# Altium project PROC101D_SCH_With_Design_Updates..Notes_V1.0.PrjPcb (part 7 of 23)

## Sheet 18.SchDoc
size 513 x 386 mm
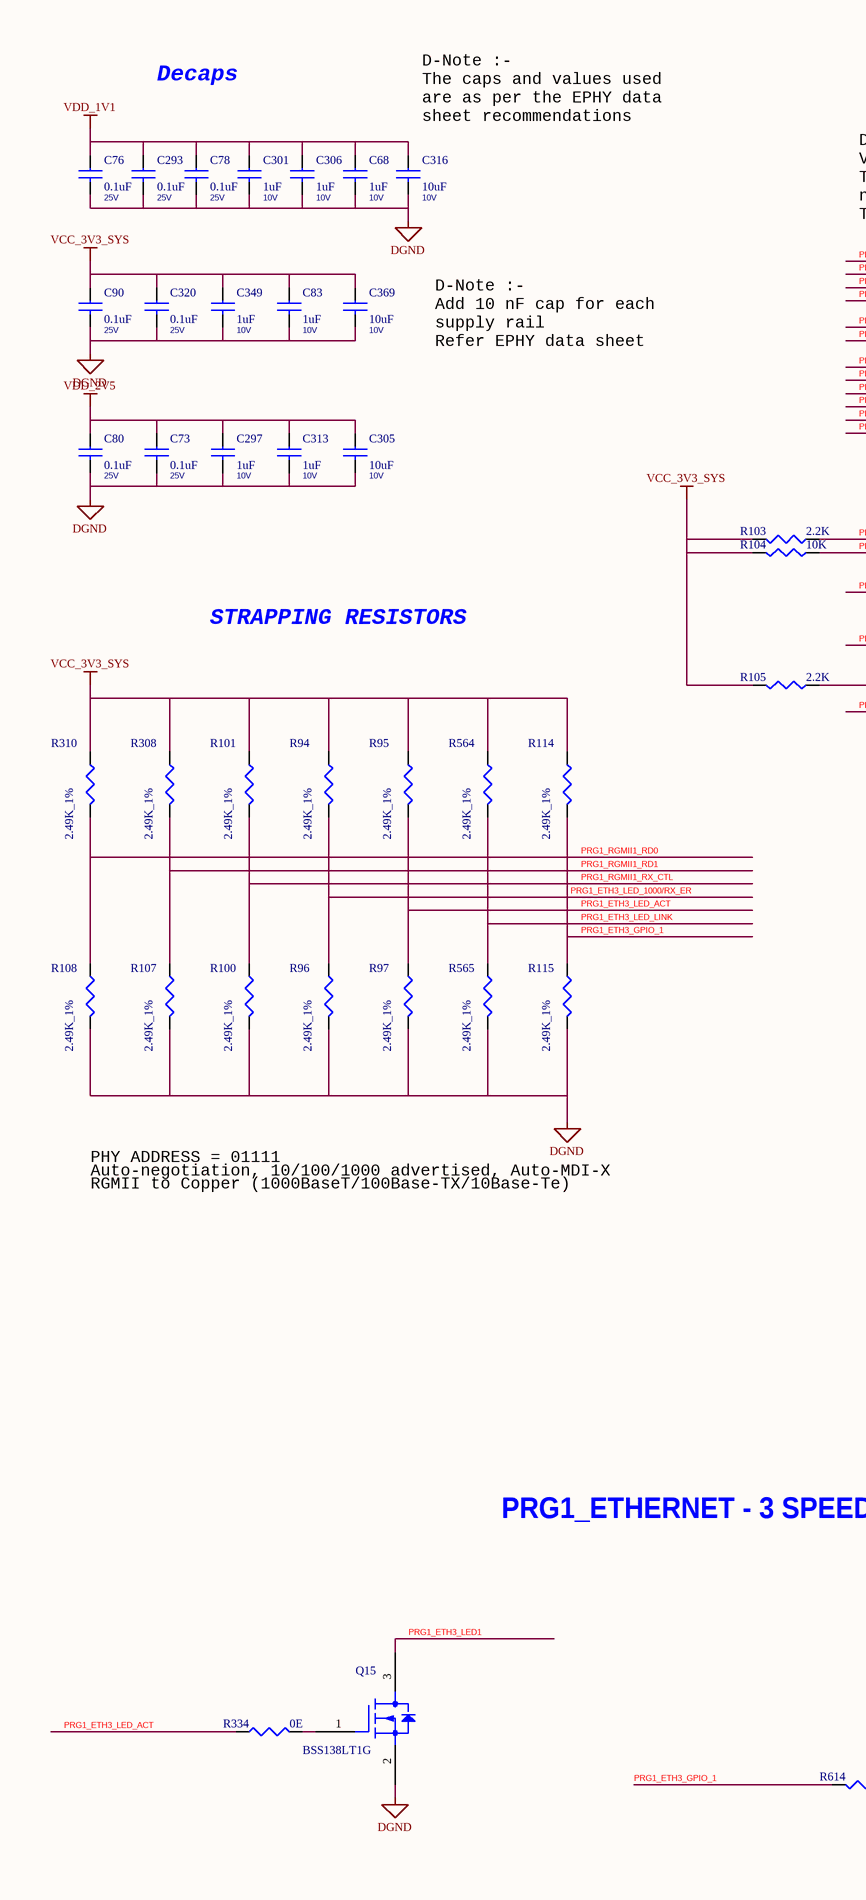
[diagram p27: 18.SchDoc, left]
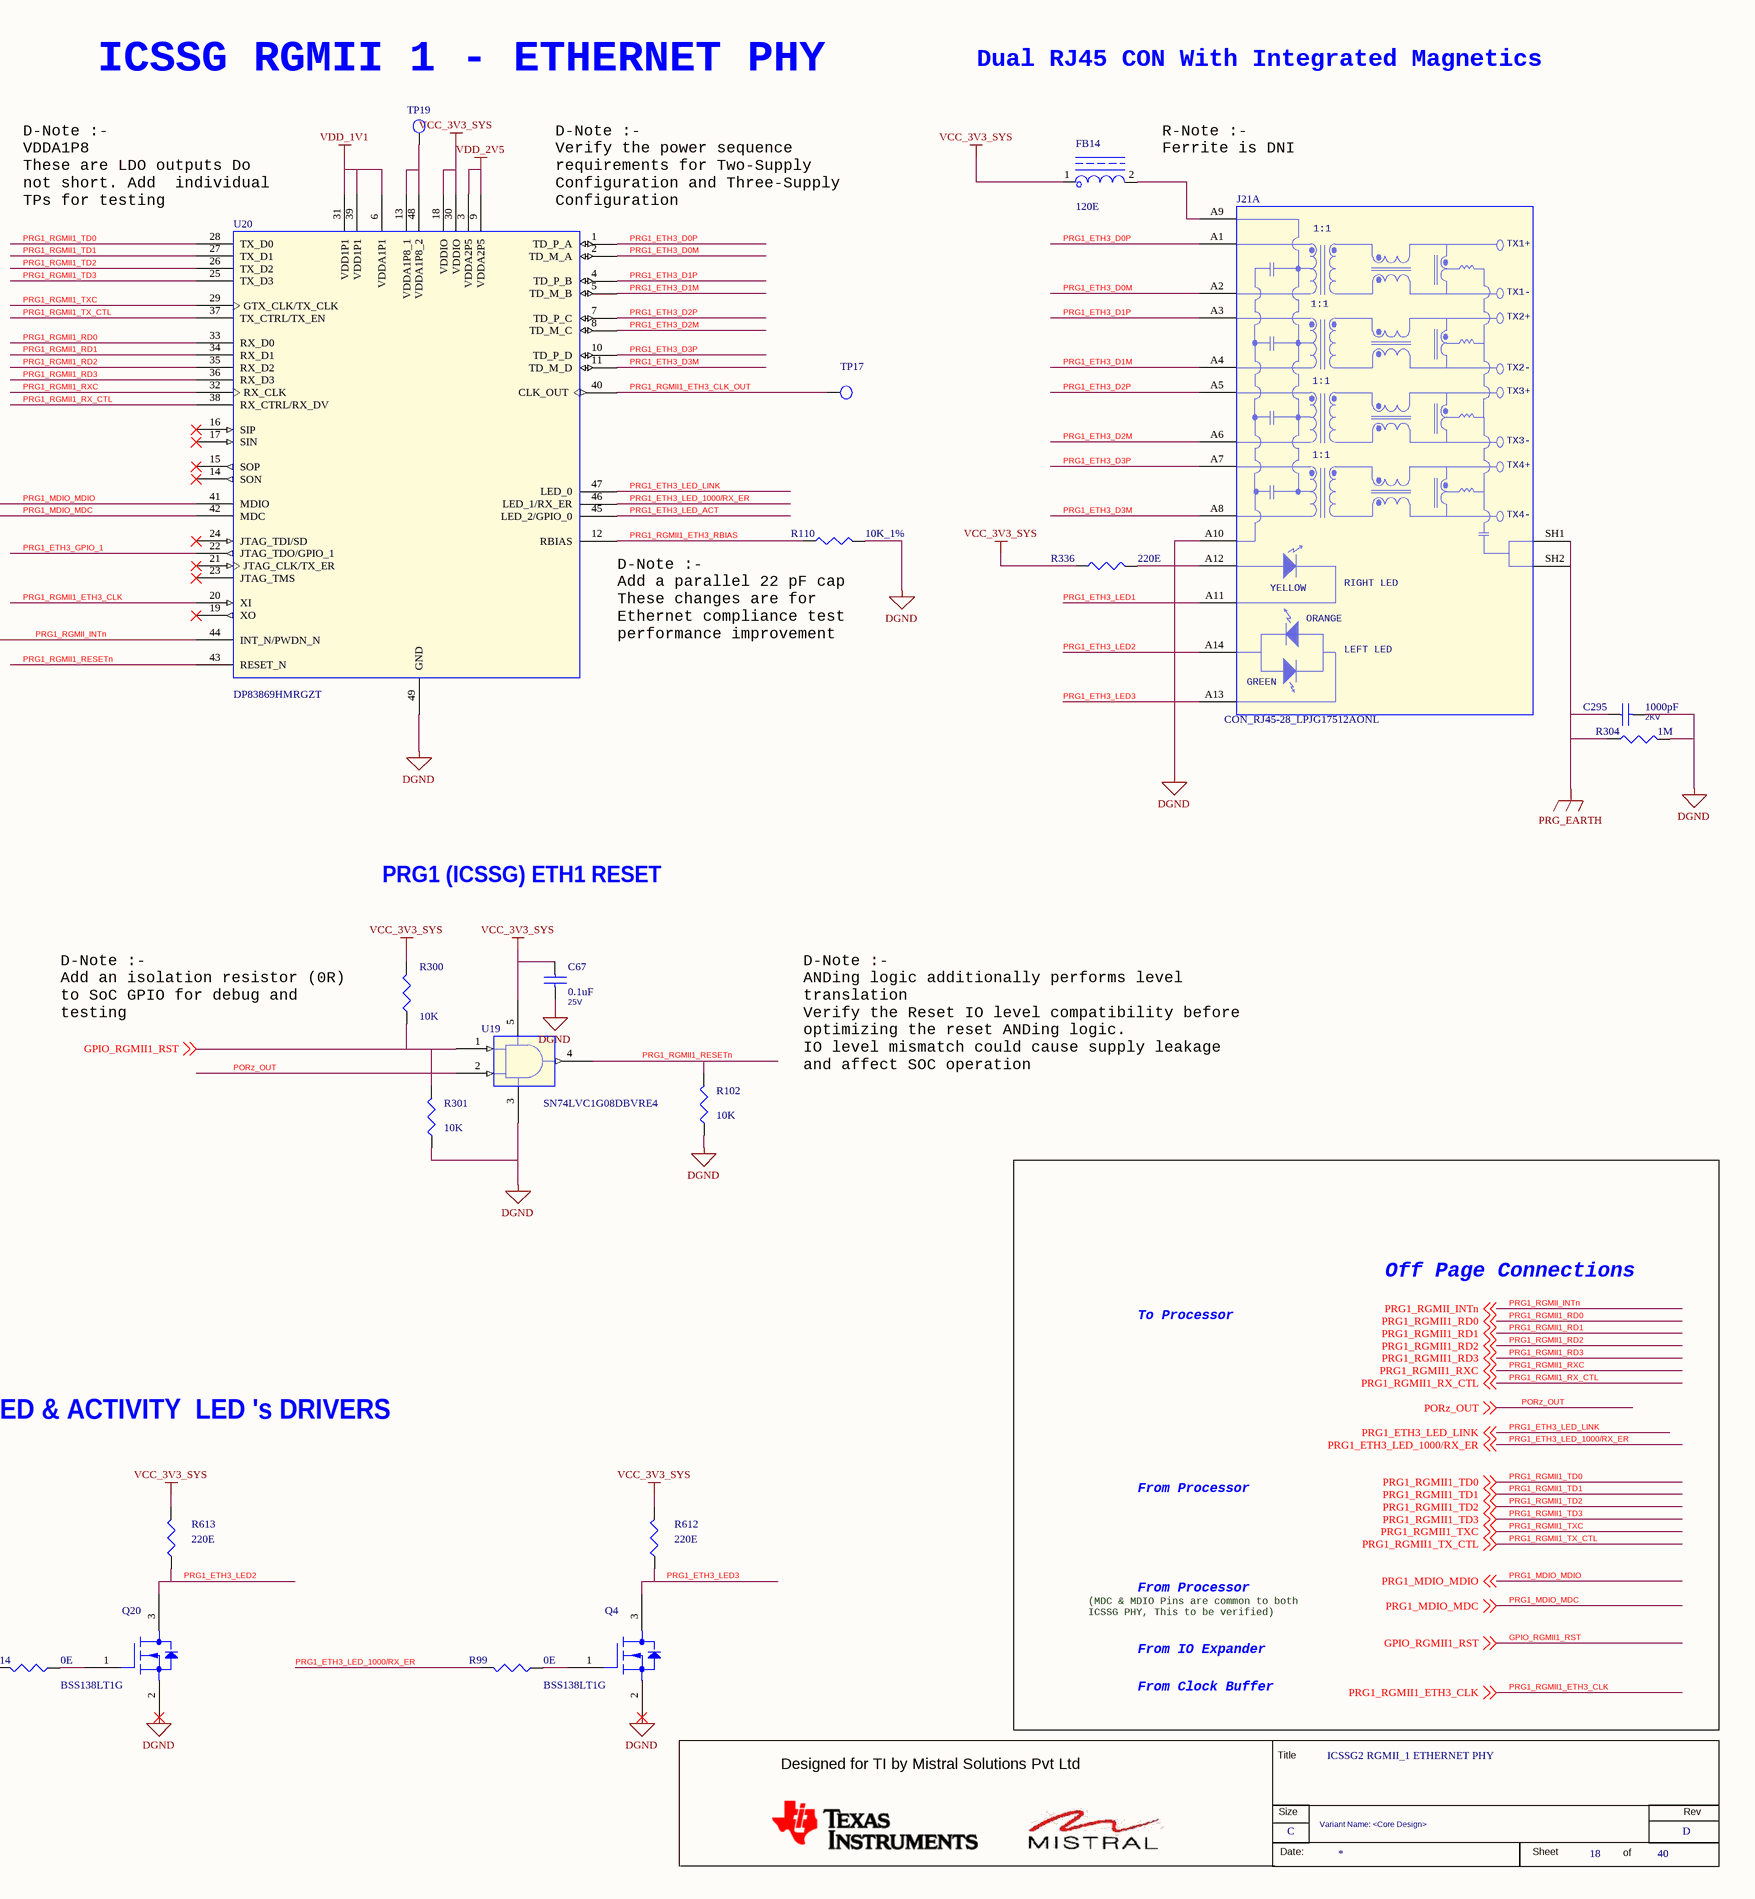
[diagram p28: 18.SchDoc, right]

### Parts
(Parts that share a designator on the sheet are numbered #1, #2 ... from top to bottom, then left to right.)
*#18  RevCode: D  Title: ICSSG2 RGMII_1 ETHERNET PHY  Page Size: C  Page Number: 18  Page Count: 40  Variant Name: <Core Design>  (hidden comment: MISTRAL_TITLEBLK_CSIZE)  (graphical)
C67  0.1uF  Voltage: 25V  [CAP0402_0-75]
C68  1uF  Voltage: 10V  [CAP0402_0-75]
C73  0.1uF  Voltage: 25V  [CAP0402_0-75]
C76  0.1uF  Voltage: 25V  [CAP0402_0-75]
C78  0.1uF  Voltage: 25V  [CAP0402_0-75]
C80  0.1uF  Voltage: 25V  [CAP0402_0-75]
C83  1uF  Voltage: 10V  [CAP0402_0-75]
C90  0.1uF  Voltage: 25V  [CAP0402_0-75]
C293  0.1uF  Voltage: 25V  [CAP0402_0-75]
C295  1000pF  Voltage: 2KV  [CAP1206_1-75]
C297  1uF  Voltage: 10V  [CAP0402_0-75]
C301  1uF  Voltage: 10V  [CAP0402_0-75]
C305  10uF  Voltage: 10V  [CAP0402_0-75]
C306  1uF  Voltage: 10V  [CAP0402_0-75]
C313  1uF  Voltage: 10V  [CAP0402_0-75]
C316  10uF  Voltage: 10V  [CAP0402_0-75]
C320  0.1uF  Voltage: 25V  [CAP0402_0-75]
C349  1uF  Voltage: 10V  [CAP0402_0-75]
C369  10uF  Voltage: 10V  [CAP0402_0-75]
FB14  120E  [IND0603_1]
J21  CON_RJ45-28_LPJG17512AONL  [CON_RJ45-28_LPJG17512_S_R_T_25-3]  (part A of 2)
Q4  BSS138LT1G  [SOT23-123_1-2]
Q15  BSS138LT1G  [SOT23-123_1-2]
Q20  BSS138LT1G  [SOT23-123_1-2]
R94  2.49K_1%  [RES0402_0-5]
R95  2.49K_1%  [RES0402_0-5]
R96  2.49K_1%  [RES0402_0-5]
R97  2.49K_1%  [RES0402_0-5]
R99  0E  [RES0402_0-5]
R100  2.49K_1%  [RES0402_0-5]
R101  2.49K_1%  [RES0402_0-5]
R102  10K  [RES0402_0-5]
R103  2.2K  [RES0402_0-5]
R104  10K  [RES0402_0-5]
R105  2.2K  [RES0402_0-5]
R107  2.49K_1%  [RES0402_0-5]
R108  2.49K_1%  [RES0402_0-5]
R110  10K_1%  [RES0402_0-5]
R114  2.49K_1%  [RES0402_0-5]
R115  2.49K_1%  [RES0402_0-5]
R300  10K  [RES0402_0-5]
R301  10K  [RES0402_0-5]
R304  1M  [RES0603_0-75]
R308  2.49K_1%  [RES0402_0-5]
R310  2.49K_1%  [RES0402_0-5]
R334  0E  [RES0402_0-5]
R336  220E  [RES0402_0-5]
R564  2.49K_1%  [RES0402_0-5]
R565  2.49K_1%  [RES0402_0-5]
R612  220E  [RES0402_0-5]
R613  220E  [RES0402_0-5]
R614  0E  [RES0402_0-5]
TP17  TP20_SMD  [TP20_SMD]  (value not drawn)
TP19  TP20_SMD  [TP20_SMD]  (value not drawn)
U19  SN74LVC1G08DBVRE4  [SOT23-5]
U20  DP83869HMRGZT  [QFN48_19-68_280X280_1_EP4-2]

### Nets
DGND: C67.2 C68.2 C73.2 C76.2 C78.2 C80.2 C83.2 C90.2 C293.2 C295.2 C297.2 C301.2 C305.2 C306.2 C313.2 C316.2 C320.2 C349.2 C369.2 J21.A10(GND) Q4.2(S) Q15.2(S) Q20.2(S) R96.2 R97.2 R100.2 R102.2 R107.2 R108.2 R110.1 R115.2 R301.2 R304.2 R565.2 U19.3(GND) U20.49(GND)
PRG_EARTH: C295.1 J21.SH1 J21.SH2 R304.1
VCC_3V3_SYS: C67.1 C83.1 C90.1 C320.1 C349.1 C369.1 FB14.1 R94.1 R95.1 R101.1 R103.2 R104.1 R105.2 R114.1 R300.2 R308.1 R310.1 R336.1 R564.1 R612.2 R613.2 U19.5(VCC) U20.18(VDDIO) U20.30(VDDIO)
VDD_1V1: C68.1 C76.1 C78.1 C293.1 C301.1 C306.1 C316.1 U20.6(VDDA1P1) U20.31(VDD1P1) U20.39(VDD1P1)
VDD_2V5: C73.1 C80.1 C297.1 C305.1 C313.1 U20.3(VDDA2P5) U20.9(VDDA2P5)
GPIO_RGMII1_RST: R300.1 R301.1 U19.1(A) ; off-sheet GPIO_RGMII1_RST
PORz_OUT: U19.2(B) ; off-sheet PORz_OUT
PRG1_ETH3_D0M: J21.A2(TD1-_1) U20.2(TD_M_A)
PRG1_ETH3_D0P: J21.A1(TD1+_1) U20.1(TD_P_A)
PRG1_ETH3_D1M: J21.A4(TD2-_1) U20.5(TD_M_B)
PRG1_ETH3_D1P: J21.A3(TD2+_1) U20.4(TD_P_B)
PRG1_ETH3_D2M: J21.A6(TD3-_1) U20.8(TD_M_C)
PRG1_ETH3_D2P: J21.A5(TD3+_1) U20.7(TD_P_C)
PRG1_ETH3_D3M: J21.A8(TD4-_1) U20.11(TD_M_D)
PRG1_ETH3_D3P: J21.A7(TD4+_1) U20.10(TD_P_D)
PRG1_ETH3_GPIO_1: R114.2 R115.1 R614.2 U20.22(JTAG_TDO/GPIO_1)
PRG1_ETH3_LED1: J21.A11 Q15.3(D)
PRG1_ETH3_LED2: J21.A14 Q20.3(D) R613.1
PRG1_ETH3_LED3: J21.A13 Q4.3(D) R612.1
PRG1_ETH3_LED_1000/RX_ER: R94.2 R96.1 R99.2 U20.46(LED_1/RX_ER) ; off-sheet PRG1_ETH3_LED_1000/RX_ER
PRG1_ETH3_LED_ACT: R95.2 R97.1 R334.1 U20.45(LED_2/GPIO_0)
PRG1_ETH3_LED_LINK: R564.2 R565.1 U20.47(LED_0) ; off-sheet PRG1_ETH3_LED_LINK
PRG1_MDIO_MDC: R104.2 U20.42(MDC) ; off-sheet PRG1_MDIO_MDC
PRG1_MDIO_MDIO: R103.1 U20.41(MDIO) ; off-sheet PRG1_MDIO_MDIO
PRG1_RGMII1_ETH3_CLK: U20.20(XI) ; off-sheet PRG1_RGMII1_ETH3_CLK
PRG1_RGMII1_ETH3_CLK_OUT: TP17.1(TP) U20.40(CLK_OUT)
PRG1_RGMII1_ETH3_RBIAS: R110.2 U20.12(RBIAS)
PRG1_RGMII1_RD0: R108.1 R310.2 U20.33(RX_D0) ; off-sheet PRG1_RGMII1_RD0
PRG1_RGMII1_RD1: R107.1 R308.2 U20.34(RX_D1) ; off-sheet PRG1_RGMII1_RD1
PRG1_RGMII1_RD2: U20.35(RX_D2) ; off-sheet PRG1_RGMII1_RD2
PRG1_RGMII1_RD3: U20.36(RX_D3) ; off-sheet PRG1_RGMII1_RD3
PRG1_RGMII1_RESETn: R102.1 U19.4(Y) U20.43(RESET_N)
PRG1_RGMII1_RX_CTL: R100.1 R101.2 U20.38(RX_CTRL/RX_DV) ; off-sheet PRG1_RGMII1_RX_CTL
PRG1_RGMII1_RXC: U20.32(RX_CLK) ; off-sheet PRG1_RGMII1_RXC
PRG1_RGMII1_TD0: U20.28(TX_D0) ; off-sheet PRG1_RGMII1_TD0
PRG1_RGMII1_TD1: U20.27(TX_D1) ; off-sheet PRG1_RGMII1_TD1
PRG1_RGMII1_TD2: U20.26(TX_D2) ; off-sheet PRG1_RGMII1_TD2
PRG1_RGMII1_TD3: U20.25(TX_D3) ; off-sheet PRG1_RGMII1_TD3
PRG1_RGMII1_TX_CTL: U20.37(TX_CTRL/TX_EN) ; off-sheet PRG1_RGMII1_TX_CTL
PRG1_RGMII1_TXC: U20.29(GTX_CLK/TX_CLK) ; off-sheet PRG1_RGMII1_TXC
PRG1_RGMII_INTn: R105.1 U20.44(INT_N/PWDN_N) ; off-sheet PRG1_RGMII_INTn
NetFB14_2: FB14.2 J21.A9(VCC)
NetJ21_A12: J21.A12 R336.2
NetQ4_1: Q4.1(G) R99.1
NetQ15_1: Q15.1(G) R334.2
NetQ20_1: Q20.1(G) R614.1
NetTP19_1: TP19.1(TP) U20.13(VDDA1P8_1) U20.48(VDDA1P8_2)

Not connected (* = marked no-connect by the designer): U20 14(SON)* 15(SOP)* 16(SIP)* 17(SIN)* 19(XO)* 21(JTAG_CLK/TX_ER)* 23(JTAG_TMS)* 24(JTAG_TDI/SD)*

### Notes on the sheet
- (near C316) D-Note :-
  The caps and values used
  are as per the EPHY data
  sheet recommendations
- Decaps
- ICSSG RGMII 1 - ETHERNET PHY
- Dual RJ45 CON With Integrated Magnetics
- (near U20) D-Note :-
  VDDA1P8
  These are LDO outputs Do
  not short. Add  individual
  TPs for testing
- (near U20) D-Note :-
  Verify the power sequence
  requirements for Two-Supply
  Configuration and Three-Supply
  Configuration
- R-Note :-
  Ferrite is DNI
- D-Note :-
  Add 10 nF cap for each
  supply rail
  Refer EPHY data sheet
- STRAPPING RESISTORS
- (near R110) D-Note :-
  Add a parallel 22 pF cap
  These changes are for
  Ethernet compliance test
  performance improvement
- PRG1 (ICSSG) ETH1 RESET
- (near R300) D-Note :-
  Add an isolation resistor (0R)
  to SoC GPIO for debug and
  testing
- D-Note :-
  ANDing logic additionally performs level
  translation
  Verify the Reset IO level compatibility before
  optimizing the reset ANDing logic.
  IO level mismatch could cause supply leakage
  and affect SOC operation
- PHY ADDRESS = 01111
- Auto-negotiation, 10/100/1000 advertised, Auto-MDI-X
- RGMII to Copper (1000BaseT/100Base-TX/10Base-Te)
- Off Page Connections
- To Processor
- PRG1_ETHERNET - 3 SPEED & ACTIVITY  LED 's DRIVERS
- From Processor
- (MDC & MDIO Pins are common to both
  ICSSG PHY, This to be verified)
- From IO Expander
- From Clock Buffer
- (in symbol CON_RJ45-28_LPJG17512AONL, part A) 1:1; TX1+; TX1-; TX2+; TX2-; TX3+; TX3-; TX4+; TX4-; RIGHT LED; YELLOW; ORANGE; LEFT LED; GREEN
- (in symbol MISTRAL_TITLEBLK_CSIZE) Title; Designed for TI by Mistral Solutions Pvt Ltd; Size; Rev; Date:; Sheet; of

### Library data of the parts
*#18 = MISTRAL_TITLEBLK_CSIZE: Issue: 1.0; Page Create Date: March  8, 1995; Page Modify Date: *
C67 C73 C76 C78 C80 C90 C293 C320 = CAP_Dup3: CAP CERAMIC 0.1uF 25V 20% X5R 0402; Alt_Mfr_name: YAGEO AMERICA; Part_type: CAPACITORS\CERAMIC; Mfr_part_number: 885012105018; Mfr_name: WURTH ELECTRONICS; Mistral Part No: 120020080003-R; Alt_Mfr_part_number: CC0402KRX5R8BB104; Custom_Duty: 15%; Customs_HS_Code: 85322990; Wattage: NA; Project: AM64x_EVM_BRD; Footprint Path: Y:\MIS_DATABASE\Library\ALTIUM_TOOL\PCB_FOOTPRINTS\Altium_Footprint_Lib.PcbLib; Library Path: Y:\MIS_DATABASE\Library\ALTIUM_TOOL\SCHEMATICS_PARTS\MS_DISCRETE_Library.schlib; Footprint Ref: CAP0402_0-75; Library Ref: CAP; MECHANICAL 3D STEP FILE: CAP0402_0-75; Chkd/date: MANIRAJA/170820; Crtd /date: ALVY/170820; Datasheet: Y:\MIS_DATABASE\DATASHEETS\CAPACITORS\885012105018.PDF; Temperature: -55癈+85癈; Weight: 0.65mg; Height: 0.55MM; Distributor_part_number: 732-7495-1-ND; Distributor_name: DIGIKEY; Package: 0402; Tolerance: 20%; PCB Footprint: CAP0402_0-75
C68 C297 C301 C313 C349 = CAP_Dup3: as C101 on sheet 17; Footprint Ref: CAP0402_0-75; Library Ref: CAP; Chkd/date: MANIRAJA/210820; Crtd /date: ALVY/190820; Datasheet: Y:\MIS_DATABASE\DATASHEETS\CAPACITORS\885012105012.PDF; Temperature: -55癈+85癈; Weight: 0.65mg; Height: 0.55MM; Distributor_part_number: 732-7489-1-ND; Distributor_name: DIGIKEY; Package: 0402; Tolerance: 20%; MECHANICAL 3D STEP FILE: CAP0402_0-75; Library Path: Y:\MIS_DATABASE\Library\ALTIUM_TOOL\SCHEMATICS_PARTS\MS_DISCRETE_Library.schlib; Footprint Path: Y:\MIS_DATABASE\Library\ALTIUM_TOOL\PCB_FOOTPRINTS\Altium_Footprint_Lib.PcbLib; PCB Footprint: CAP0402_0-75
C83 C306 = CAP_Dup3: as C401 on sheet 17; Footprint Path: Y:\MIS_DATABASE\Library\ALTIUM_TOOL\PCB_FOOTPRINTS\Altium_Footprint_Lib.PcbLib; Library Path: Y:\MIS_DATABASE\Library\ALTIUM_TOOL\SCHEMATICS_PARTS\MS_DISCRETE_Library.schlib; MECHANICAL 3D STEP FILE: CAP0402_0-75; Tolerance: 20%; Package: 0402; Distributor_name: DIGIKEY; Distributor_part_number: 732-7489-1-ND; Height: 0.55MM; Weight: 0.65mg; Temperature: -55癈+85癈; Datasheet: Y:\MIS_DATABASE\DATASHEETS\CAPACITORS\885012105012.PDF; Crtd /date: ALVY/190820; Chkd/date: MANIRAJA/210820; Library Ref: CAP; Footprint Ref: CAP0402_0-75; PCB Footprint: CAP0402_0-75
C295 = CAP_Dup3: CAP CERAMIC 1000pF 2KV 10% X7R 1206; Mistral Part No: 120015080006-R; Mfr_name: AVX CORPORATION; Mfr_part_number: 1206GC102KAT1A; Part_type: CAPACITORS\CERAMIC; Project: ADR1B; Customs_HS_Code: 85322990; Custom_Duty: 15%; Wattage: NA; Tolerance: 10%; Package: 1206; Distributor_name: DIGIKEY; Distributor_part_number: 478-2956-1-ND; Height: 1.52MM; Weight: 16.2mg; Temperature: -55癈+125癈; Datasheet: Y:\MIS_DATABASE\DATASHEETS\CAPACITORS\AVX_HV-MLC.PDF; Crtd /date: MAZHAR/281106; Chkd/date: SHREESHAIL/291106; Library Ref: CAP; Footprint Ref: CAP1206_1-75; Library Path: Y:\MIS_DATABASE\Library\ALTIUM_TOOL\SCHEMATICS_PARTS\MS_DISCRETE_Library.schlib; Footprint Path: Y:\MIS_DATABASE\Library\ALTIUM_TOOL\PCB_FOOTPRINTS\Altium_Footprint_Lib.PcbLib; MECHANICAL 3D STEP FILE: CAP1206_1-75; PCB Footprint: CAP1206_1-75
C305 = CAP_Dup3: as C111 on sheet 17; Footprint Path: Y:\MIS_DATABASE\Library\ALTIUM_TOOL\PCB_FOOTPRINTS\Altium_Footprint_Lib.PcbLib; Library Path: Y:\MIS_DATABASE\Library\ALTIUM_TOOL\SCHEMATICS_PARTS\MS_DISCRETE_Library.schlib; Footprint Ref: CAP0402_0-75; Chkd/date: MANIRAJA/300520; Crtd /date: ALVY/260520; Datasheet: Y:\MIS_DATABASE\DATASHEETS\CAPACITORS\MURATA-GXX-SER_NOV17.PDF; Height: 0.55MM; Distributor_part_number: 490-GRM155R61A106ME11DTR-ND; Distributor_name: DIGIKEY; Package: 0402; Tolerance: 20%; Weight: 3.1mg; Temperature: -55癈+85癈; MECHANICAL 3D STEP FILE: CAP0402_0-75; Library Ref: CAP; PCB Footprint: CAP0402_0-75
C316 = CAP_Dup3: as C105 on sheet 17; Footprint Path: Y:\MIS_DATABASE\Library\ALTIUM_TOOL\PCB_FOOTPRINTS\Altium_Footprint_Lib.PcbLib; Library Path: Y:\MIS_DATABASE\Library\ALTIUM_TOOL\SCHEMATICS_PARTS\MS_DISCRETE_Library.schlib; Footprint Ref: CAP0402_0-75; Library Ref: CAP; MECHANICAL 3D STEP FILE: CAP0402_0-75; Temperature: -55癈+85癈; Weight: 3.1mg; Tolerance: 20%; Package: 0402; Distributor_name: DIGIKEY; Distributor_part_number: 490-GRM155R61A106ME11DTR-ND; Height: 0.55MM; Datasheet: Y:\MIS_DATABASE\DATASHEETS\CAPACITORS\MURATA-GXX-SER_NOV17.PDF; Crtd /date: ALVY/260520; Chkd/date: MANIRAJA/300520; PCB Footprint: CAP0402_0-75
C369 = CAP_Dup3: as C99 on sheet 17; Footprint Path: Y:\MIS_DATABASE\Library\ALTIUM_TOOL\PCB_FOOTPRINTS\Altium_Footprint_Lib.PcbLib; Library Path: Y:\MIS_DATABASE\Library\ALTIUM_TOOL\SCHEMATICS_PARTS\MS_DISCRETE_Library.schlib; Footprint Ref: CAP0402_0-75; Library Ref: CAP; MECHANICAL 3D STEP FILE: CAP0402_0-75; Temperature: -55癈+85癈; Weight: 3.1mg; Chkd/date: MANIRAJA/300520; Crtd /date: ALVY/260520; Datasheet: Y:\MIS_DATABASE\DATASHEETS\CAPACITORS\MURATA-GXX-SER_NOV17.PDF; Height: 0.55MM; Distributor_part_number: 490-GRM155R61A106ME11DTR-ND; Distributor_name: DIGIKEY; Package: 0402; Tolerance: 20%; PCB Footprint: CAP0402_0-75
FB14 = INDUCTOR_FERRITE: as FB19 on sheet 17; PCB Footprint: IND0603_1; Footprint Ref: IND0603_1; Part_type: INDUCTOR; Wattage: NA; Package: 0603; Distributor_name: DIGIKEY; Distributor_part_number: 732-782631141CT-ND; Library Ref: INDUCTOR_FERRITE; Height: 1.00MM; Weight: NA; Temperature: -55癈+125癈; Datasheet: Y:\MIS_DATABASE\DATASHEETS\DISCRETES\INDUCTORS\782631141.PDF; Crtd /date: ALVY/180820; Chkd/date: MANIRAJA/180820; MECHANICAL 3D STEP FILE: IND0603_1; Library Path: Y:\MIS_DATABASE\Library\ALTIUM_TOOL\SCHEMATICS_PARTS\MS_FILTER_Library.schlib; Footprint Path: Y:\MIS_DATABASE\Library\ALTIUM_TOOL\PCB_FOOTPRINTS\Altium_Footprint_Lib.PcbLib
J21 = CON_RJ45-28_LPJG17512AONL: as J21 on sheet 17; Mfr_part_number: LPJG17512AONL; Voltage: NA; Wattage: NA; Package: THRU-HOLE; Distributor_name: NA; Distributor_part_number: NA; Height: 25.30MM; Weight: NA; Temperature: 0癈+70癈; Datasheet: Y:\MIS_DATABASE\DATASHEETS\CONNECTORS\LPJG17512AONL.PDF; Crtd /date: MANIRAJA/010817; Chkd/date: MANIRAJA/010817; MECHANICAL 3D STEP FILE: CON_RJ45-28_LPJG17512_S_R_T_25-3; Library Ref: CON_RJ45-28_LPJG17512AONL; PCB Footprint: CON_RJ45-28_LPJG17512_S_R_T_25-3
Q4 Q15 Q20 = MOSFET_BSS138LT1G: as Q14 on sheet 17; Footprint Path: Y:\MIS_DATABASE\Library\ALTIUM_TOOL\PCB_FOOTPRINTS\Altium_Footprint_Lib.PcbLib; Library Path: Y:\MIS_DATABASE\Library\ALTIUM_TOOL\SCHEMATICS_PARTS\MS_MOSFET_Library.schlib; MECHANICAL 3D STEP FILE: SOT23-123_1-2; Footprint Ref: SOT23-123_1-2; Mfr_part_number: BSS138LT1G; Voltage: NA; Wattage: NA; Package: SOT23-3; Distributor_name: DIGIKEY; Distributor_part_number: BSS138LT1GOSCT-ND; Height: 1.11MM; Weight: 8mg; Temperature: -55癈+150癈; Datasheet: Y:\MIS_DATABASE\DATASHEETS\DISCRETES\TRANSISTORS_FETS\BSS138LT1G.PDF; Crtd /date: JEBRAN/060416; Chkd/date: MANIRAJA/250219; Library Ref: MOSFET_BSS138W; PCB Footprint: SOT23-123_1-2
R94 R97 R115 R308 R310 R564 R565 = RESISTOR_Dup6: as R135 on sheet 17; Tolerance: 1%; Wattage: 1/16W; Package: 0402; Distributor_name: DIGIKEY; Distributor_part_number: 311-2.49KLRCT-ND; Height: 0.40MM; Weight: 0.65mg; Temperature: -55癈+155癈; Datasheet: Y:\MIS_DATABASE\DATASHEETS\RESISTORS\RCXXXXL-SER_MAR18.PDF; Crtd /date: VASANTHA/270516; Chkd/date: VASANTHA/270516; Library Ref: RESISTOR; Footprint Ref: RES0402_0-5; MECHANICAL 3D STEP FILE: RES0402_0-5; Library Path: Y:\MIS_DATABASE\Library\ALTIUM_TOOL\SCHEMATICS_PARTS\MS_DISCRETE_Library.schlib; Footprint Path: Y:\MIS_DATABASE\Library\ALTIUM_TOOL\PCB_FOOTPRINTS\Altium_Footprint_Lib.PcbLib; PCB Footprint: RES0402_0-5
R95 R96 R100 R101 R107 R108 R114 = RESISTOR_Dup6: as R126 on sheet 17; Library Ref: RESISTOR; Chkd/date: VASANTHA/270516; Crtd /date: VASANTHA/270516; Datasheet: Y:\MIS_DATABASE\DATASHEETS\RESISTORS\RCXXXXL-SER_MAR18.PDF; Temperature: -55癈+155癈; Weight: 0.65mg; Height: 0.40MM; Distributor_part_number: 311-2.49KLRCT-ND; Distributor_name: DIGIKEY; Package: 0402; Wattage: 1/16W; Tolerance: 1%; Footprint Ref: RES0402_0-5; MECHANICAL 3D STEP FILE: RES0402_0-5; Library Path: Y:\MIS_DATABASE\Library\ALTIUM_TOOL\SCHEMATICS_PARTS\MS_DISCRETE_Library.schlib; Footprint Path: Y:\MIS_DATABASE\Library\ALTIUM_TOOL\PCB_FOOTPRINTS\Altium_Footprint_Lib.PcbLib; PCB Footprint: RES0402_0-5
R99 R614 = RESISTOR_Dup5: RES 0E 1/16W JUMPER 0402; Mistral Part No: 110010080019-R; Mfr_name: VISHAY; Mfr_part_number: CRCW04020000Z0ED; Part_type: RESISTORS\FIXED; Project: PB_BUGBASE; Tolerance: NA; Customs_HS_Code: 85332119; Custom_Duty: 15%; Voltage: NA; Wattage: 1/16W; Package: 0402; Distributor_name: DIGIKEY; Distributor_part_number: 541-0.0JCT-ND; Height: 0.40MM; Weight: 0.65mg; Temperature: -55癈+155癈; Datasheet: Y:\MIS_DATABASE\DATASHEETS\RESISTORS\CRCW0603.PDF; Crtd /date: MUDDU/190810; Chkd/date: VASANTHA/201216; MECHANICAL 3D STEP FILE: RES0402_0-5; Library Ref: RESISTOR; Footprint Ref: RES0402_0-5; Library Path: Y:\MIS_DATABASE\Library\ALTIUM_TOOL\SCHEMATICS_PARTS\MS_DISCRETE_Library.schlib; Footprint Path: Y:\MIS_DATABASE\Library\ALTIUM_TOOL\PCB_FOOTPRINTS\Altium_Footprint_Lib.PcbLib; PCB Footprint: RES0402_0-5
R102 R104 R300 = RESISTOR_Dup6: as R120 on sheet 17; Tolerance: 5%; Wattage: 1/16W; Package: 0402; Distributor_name: DIGIKEY; Distributor_part_number: 311-10KJRCT-ND; Height: 0.40MM; Weight: 0.65mg; Temperature: -55癈+155癈; Datasheet: Y:\MIS_DATABASE\DATASHEETS\RESISTORS\RCXXXXL-SER_MAR18.PDF; Crtd /date: MAZHAR/230805; Chkd/date: VASANTHA/061216; MECHANICAL 3D STEP FILE: RES0402_0-5; Library Ref: RESISTOR; Footprint Ref: RES0402_0-5; Library Path: Y:\MIS_DATABASE\Library\ALTIUM_TOOL\SCHEMATICS_PARTS\MS_DISCRETE_Library.schlib; Footprint Path: Y:\MIS_DATABASE\Library\ALTIUM_TOOL\PCB_FOOTPRINTS\Altium_Footprint_Lib.PcbLib; PCB Footprint: RES0402_0-5
R103 R105 = RESISTOR_Dup6: RES 2.2K 1/16W 5% 0402; Mistral Part No: 110010120018-R; Mfr_name: YAGEO AMERICA; Mfr_part_number: RC0402JR-072K2L; Part_type: RESISTORS\FIXED; Project: TE4; Voltage: NA; Customs_HS_Code: 85332119; Custom_Duty: 15%; Tolerance: 5%; Wattage: 1/16W; Package: 0402; Distributor_name: DIGIKEY; Distributor_part_number: 311-2.2KJRCT-ND; Height: 0.40MM; Weight: 0.65mg; Temperature: -55癈+155癈; Datasheet: Y:\MIS_DATABASE\DATASHEETS\RESISTORS\RCXXXXL-SER_MAR18.PDF; Crtd /date: BAVISH/021210; Chkd/date: VASANTHA/061216; MECHANICAL 3D STEP FILE: RES0402_0-5; Footprint Path: Y:\MIS_DATABASE\Library\ALTIUM_TOOL\PCB_FOOTPRINTS\Altium_Footprint_Lib.PcbLib; Library Ref: RESISTOR; Footprint Ref: RES0402_0-5; Library Path: Y:\MIS_DATABASE\Library\ALTIUM_TOOL\SCHEMATICS_PARTS\MS_DISCRETE_Library.schlib; PCB Footprint: RES0402_0-5
R110 = RESISTOR_Dup6: as R349 on sheet 17; Library Ref: RESISTOR; MECHANICAL 3D STEP FILE: RES0402_0-5; Chkd/date: MANIRAJA/191020; Crtd /date: ALVY/191020; Datasheet: Y:\MIS_DATABASE\DATASHEETS\RESISTORS\MCTXXXXM-SER.PDF; Temperature: -55癈+175癈; Weight: 0.65mg; Height: 0.37MM; Distributor_part_number: MCS0402-10.0K-MFCT-ND; Distributor_name: DIGIKEY; Package: 0402; Wattage: 1/10W; Tolerance: 1%; Footprint Ref: RES0402_0-5; Library Path: Y:\MIS_DATABASE\Library\ALTIUM_TOOL\SCHEMATICS_PARTS\MS_DISCRETE_Library.schlib; Footprint Path: Y:\MIS_DATABASE\Library\ALTIUM_TOOL\PCB_FOOTPRINTS\Altium_Footprint_Lib.PcbLib; PCB Footprint: RES0402_0-5
R301 = RESISTOR_Dup6: as R121 on sheet 17; Footprint Path: Y:\MIS_DATABASE\Library\ALTIUM_TOOL\PCB_FOOTPRINTS\Altium_Footprint_Lib.PcbLib; Library Path: Y:\MIS_DATABASE\Library\ALTIUM_TOOL\SCHEMATICS_PARTS\MS_DISCRETE_Library.schlib; Footprint Ref: RES0402_0-5; Library Ref: RESISTOR; MECHANICAL 3D STEP FILE: RES0402_0-5; Chkd/date: VASANTHA/061216; Crtd /date: MAZHAR/230805; Datasheet: Y:\MIS_DATABASE\DATASHEETS\RESISTORS\RCXXXXL-SER_MAR18.PDF; Temperature: -55癈+155癈; Weight: 0.65mg; Height: 0.40MM; Distributor_part_number: 311-10KJRCT-ND; Distributor_name: DIGIKEY; Package: 0402; Wattage: 1/16W; Tolerance: 5%; PCB Footprint: RES0402_0-5
R304 = RESISTOR_Dup6: RES 1M 1/10W 5% 0603; Mistral Part No: 110009030413-R; Mfr_name: PANASONIC-ECG; Mfr_part_number: ERJ-3GEYJ105V; Part_type: RESISTORS\FIXED; Project: BSN; Voltage: NA; Customs_HS_Code: 85332119; Custom_Duty: 15%; Footprint Path: Y:\MIS_DATABASE\Library\ALTIUM_TOOL\PCB_FOOTPRINTS\Altium_Footprint_Lib.PcbLib; Library Path: Y:\MIS_DATABASE\Library\ALTIUM_TOOL\SCHEMATICS_PARTS\MS_DISCRETE_Library.schlib; Footprint Ref: RES0603_0-75; Library Ref: RESISTOR; Tolerance: 5%; Wattage: 1/10W; Package: 0603; Distributor_name: DIGIKEY; Distributor_part_number: P1.0MGCT-ND; Height: 0.55MM; Weight: 2mg; Temperature: -55癈+155癈; Datasheet: Y:\MIS_DATABASE\DATASHEETS\RESISTORS\PAN-ERJSER_NOV17.PDF; Crtd /date: USMAN/111207; Chkd/date: VASANTHA/060217; MECHANICAL 3D STEP FILE: RES0603_0-75; PCB Footprint: RES0603_0-75
R334 = RESISTOR_Dup5: as R324 on sheet 17; Footprint Path: Y:\MIS_DATABASE\Library\ALTIUM_TOOL\PCB_FOOTPRINTS\Altium_Footprint_Lib.PcbLib; Library Path: Y:\MIS_DATABASE\Library\ALTIUM_TOOL\SCHEMATICS_PARTS\MS_DISCRETE_Library.schlib; Footprint Ref: RES0402_0-5; Library Ref: RESISTOR; MECHANICAL 3D STEP FILE: RES0402_0-5; Chkd/date: VASANTHA/201216; Crtd /date: MUDDU/190810; Datasheet: Y:\MIS_DATABASE\DATASHEETS\RESISTORS\CRCW0603.PDF; Temperature: -55癈+155癈; Weight: 0.65mg; Height: 0.40MM; Distributor_part_number: 541-0.0JCT-ND; Distributor_name: DIGIKEY; Package: 0402; Wattage: 1/16W; Tolerance: NA; PCB Footprint: RES0402_0-5
R336 = RESISTOR_Dup6: as R347 on sheet 17; Footprint Ref: RES0402_0-5; Tolerance: 5%; Wattage: 1/10W; Package: 0402; Distributor_name: DIGIKEY; Distributor_part_number: P220JCT-ND; Height: 0.40MM; Datasheet: Y:\MIS_DATABASE\DATASHEETS\RESISTORS\PAN-ERJSER_NOV17.PDF; Crtd /date: GEETHA/260406; Chkd/date: VASANTHA/291216; Library Ref: RESISTOR; Weight: 0.8mg; Temperature: -55癈+155癈; MECHANICAL 3D STEP FILE: RES0402_0-5; Library Path: Y:\MIS_DATABASE\Library\ALTIUM_TOOL\SCHEMATICS_PARTS\MS_DISCRETE_Library.schlib; Footprint Path: Y:\MIS_DATABASE\Library\ALTIUM_TOOL\PCB_FOOTPRINTS\Altium_Footprint_Lib.PcbLib; PCB Footprint: RES0402_0-5
R612 R613 = RESISTOR_Dup6: RES 220E 1/10W 5% 0402; Part_type: RESISTORS\FIXED; Mfr_part_number: ERJ-2GEJ221X; Mfr_name: PANASONIC-ECG; Mistral Part No: 110009030506-R; Custom_Duty: 15%; Customs_HS_Code: 85332119; Project: RED EYE; Voltage: NA; Chkd/date: VASANTHA/291216; Crtd /date: GEETHA/260406; Datasheet: Y:\MIS_DATABASE\DATASHEETS\RESISTORS\PAN-ERJSER_NOV17.PDF; Height: 0.40MM; Distributor_part_number: P220JCT-ND; Distributor_name: DIGIKEY; Package: 0402; Wattage: 1/10W; Tolerance: 5%; Library Ref: RESISTOR; Weight: 0.8mg; Temperature: -55癈+155癈; MECHANICAL 3D STEP FILE: RES0402_0-5; Library Path: Y:\MIS_DATABASE\Library\ALTIUM_TOOL\SCHEMATICS_PARTS\MS_DISCRETE_Library.schlib; Footprint Path: Y:\MIS_DATABASE\Library\ALTIUM_TOOL\PCB_FOOTPRINTS\Altium_Footprint_Lib.PcbLib; Footprint Ref: RES0402_0-5; PCB Footprint: RES0402_0-5
TP17 = TESTPOINT: TESTPOINT CIR 20 SMD; Mfr_name: LOCAL; MECHANICAL 3D STEP FILE: NA; Project: BT MODULE_CSRBC04; RoHS: NA; Footprint Ref: TP20_SMD; Library Ref: TESTPOINT; Footprint Path: Y:\MIS_DATABASE\Library\ALTIUM_TOOL\PCB_FOOTPRINTS\Altium_Footprint_Lib.PcbLib; Library Path: Y:\MIS_DATABASE\Library\ALTIUM_TOOL\SCHEMATICS_PARTS\MS_DISCRETE_Library.schlib; Datasheet: NA; Temperature: NA; Weight: NA; Wattage: NA; Voltage: NA; Tolerance: NA; Mistral Part No: NA; Mfr_part_number: TP20_SMD; Part_type: TESTPOINT; Package: SMD; Distributor_name: NA; Distributor_part_number: NA; Height: NA; Crtd /date: MAZHAR/171006; Chkd/date: SHREESHAIL/171006; Customs_HS_Code: NA; Custom_Duty: NA; PCB Footprint: TP20_SMD
TP19 = TESTPOINT: TESTPOINT CIR 20 SMD; Mistral Part No: NA; Mfr_name: LOCAL; Project: BT MODULE_CSRBC04; RoHS: NA; Footprint Ref: TP20_SMD; Library Ref: TESTPOINT; Mfr_part_number: TP20_SMD; Part_type: TESTPOINT; Package: SMD; Distributor_name: NA; Distributor_part_number: NA; Height: NA; Crtd /date: MAZHAR/171006; Chkd/date: SHREESHAIL/171006; Tolerance: NA; Voltage: NA; Wattage: NA; Weight: NA; Temperature: NA; Datasheet: NA; MECHANICAL 3D STEP FILE: NA; Library Path: Y:\MIS_DATABASE\Library\ALTIUM_TOOL\SCHEMATICS_PARTS\MS_DISCRETE_Library.schlib; Footprint Path: Y:\MIS_DATABASE\Library\ALTIUM_TOOL\PCB_FOOTPRINTS\Altium_Footprint_Lib.PcbLib; Customs_HS_Code: NA; Custom_Duty: NA; PCB Footprint: TP20_SMD
U19 = SN74LVC1G08DBVRE4_SOT23-5: as U31 on sheet 17; PCB Footprint: SOT23-5; RoHS: Sb/ Br FREE; Chkd/date: SUHAS/221010; Crtd /date: USMAN/151008; Datasheet: Y:\MIS_DATABASE\DATASHEETS\ICS\DIGITAL\GATES\SN74LVC1G08.PDF; Temperature: -40癈+85癈; Height: 1.45MM; Library Ref: SN74LVC1G08DBVRE4_SOT23-5; Distributor_part_number: SN74LVC1G08DBVRE4-ND; Distributor_name: DIGIKEY; Package: SOT23-5; Mfr_part_number: SN74LVC1G08DBVRE4
U20 = DP83869HM_VQFN48: as U80 on sheet 17; Footprint Ref: QFN48_19-68_280X280_1_EP4-2; Mfr_part_number: DP83869HMRGZT; Voltage: NA; Wattage: NA; Package: VQFN48; Distributor_name: DIGIKEY; Distributor_part_number: 296-53377-1-ND; Library Ref: DP83869HM_VQFN48; Height: 1.00MM; Weight: NA; Temperature: -40癈+125癈; Datasheet: Y:\MIS_DATABASE\DATASHEETS\ICS\TELECOM\DP83869HM.PDF; Crtd /date: ALVY/060519; Chkd/date: MANIRAJA/060519; MECHANICAL 3D STEP FILE: QFN48_19-68_280X280_1_EP4-2; Library Path: Y:\MIS_DATABASE\Library\ALTIUM_TOOL\SCHEMATICS_PARTS\MS_TELECOM_Library.schlib; Footprint Path: Y:\MIS_DATABASE\Library\ALTIUM_TOOL\PCB_FOOTPRINTS\Altium_Footprint_Lib.PcbLib; PCB Footprint: QFN48_19-68_280X280_1_EP4-2

## Sheet 19.SchDoc
size 513 x 386 mm
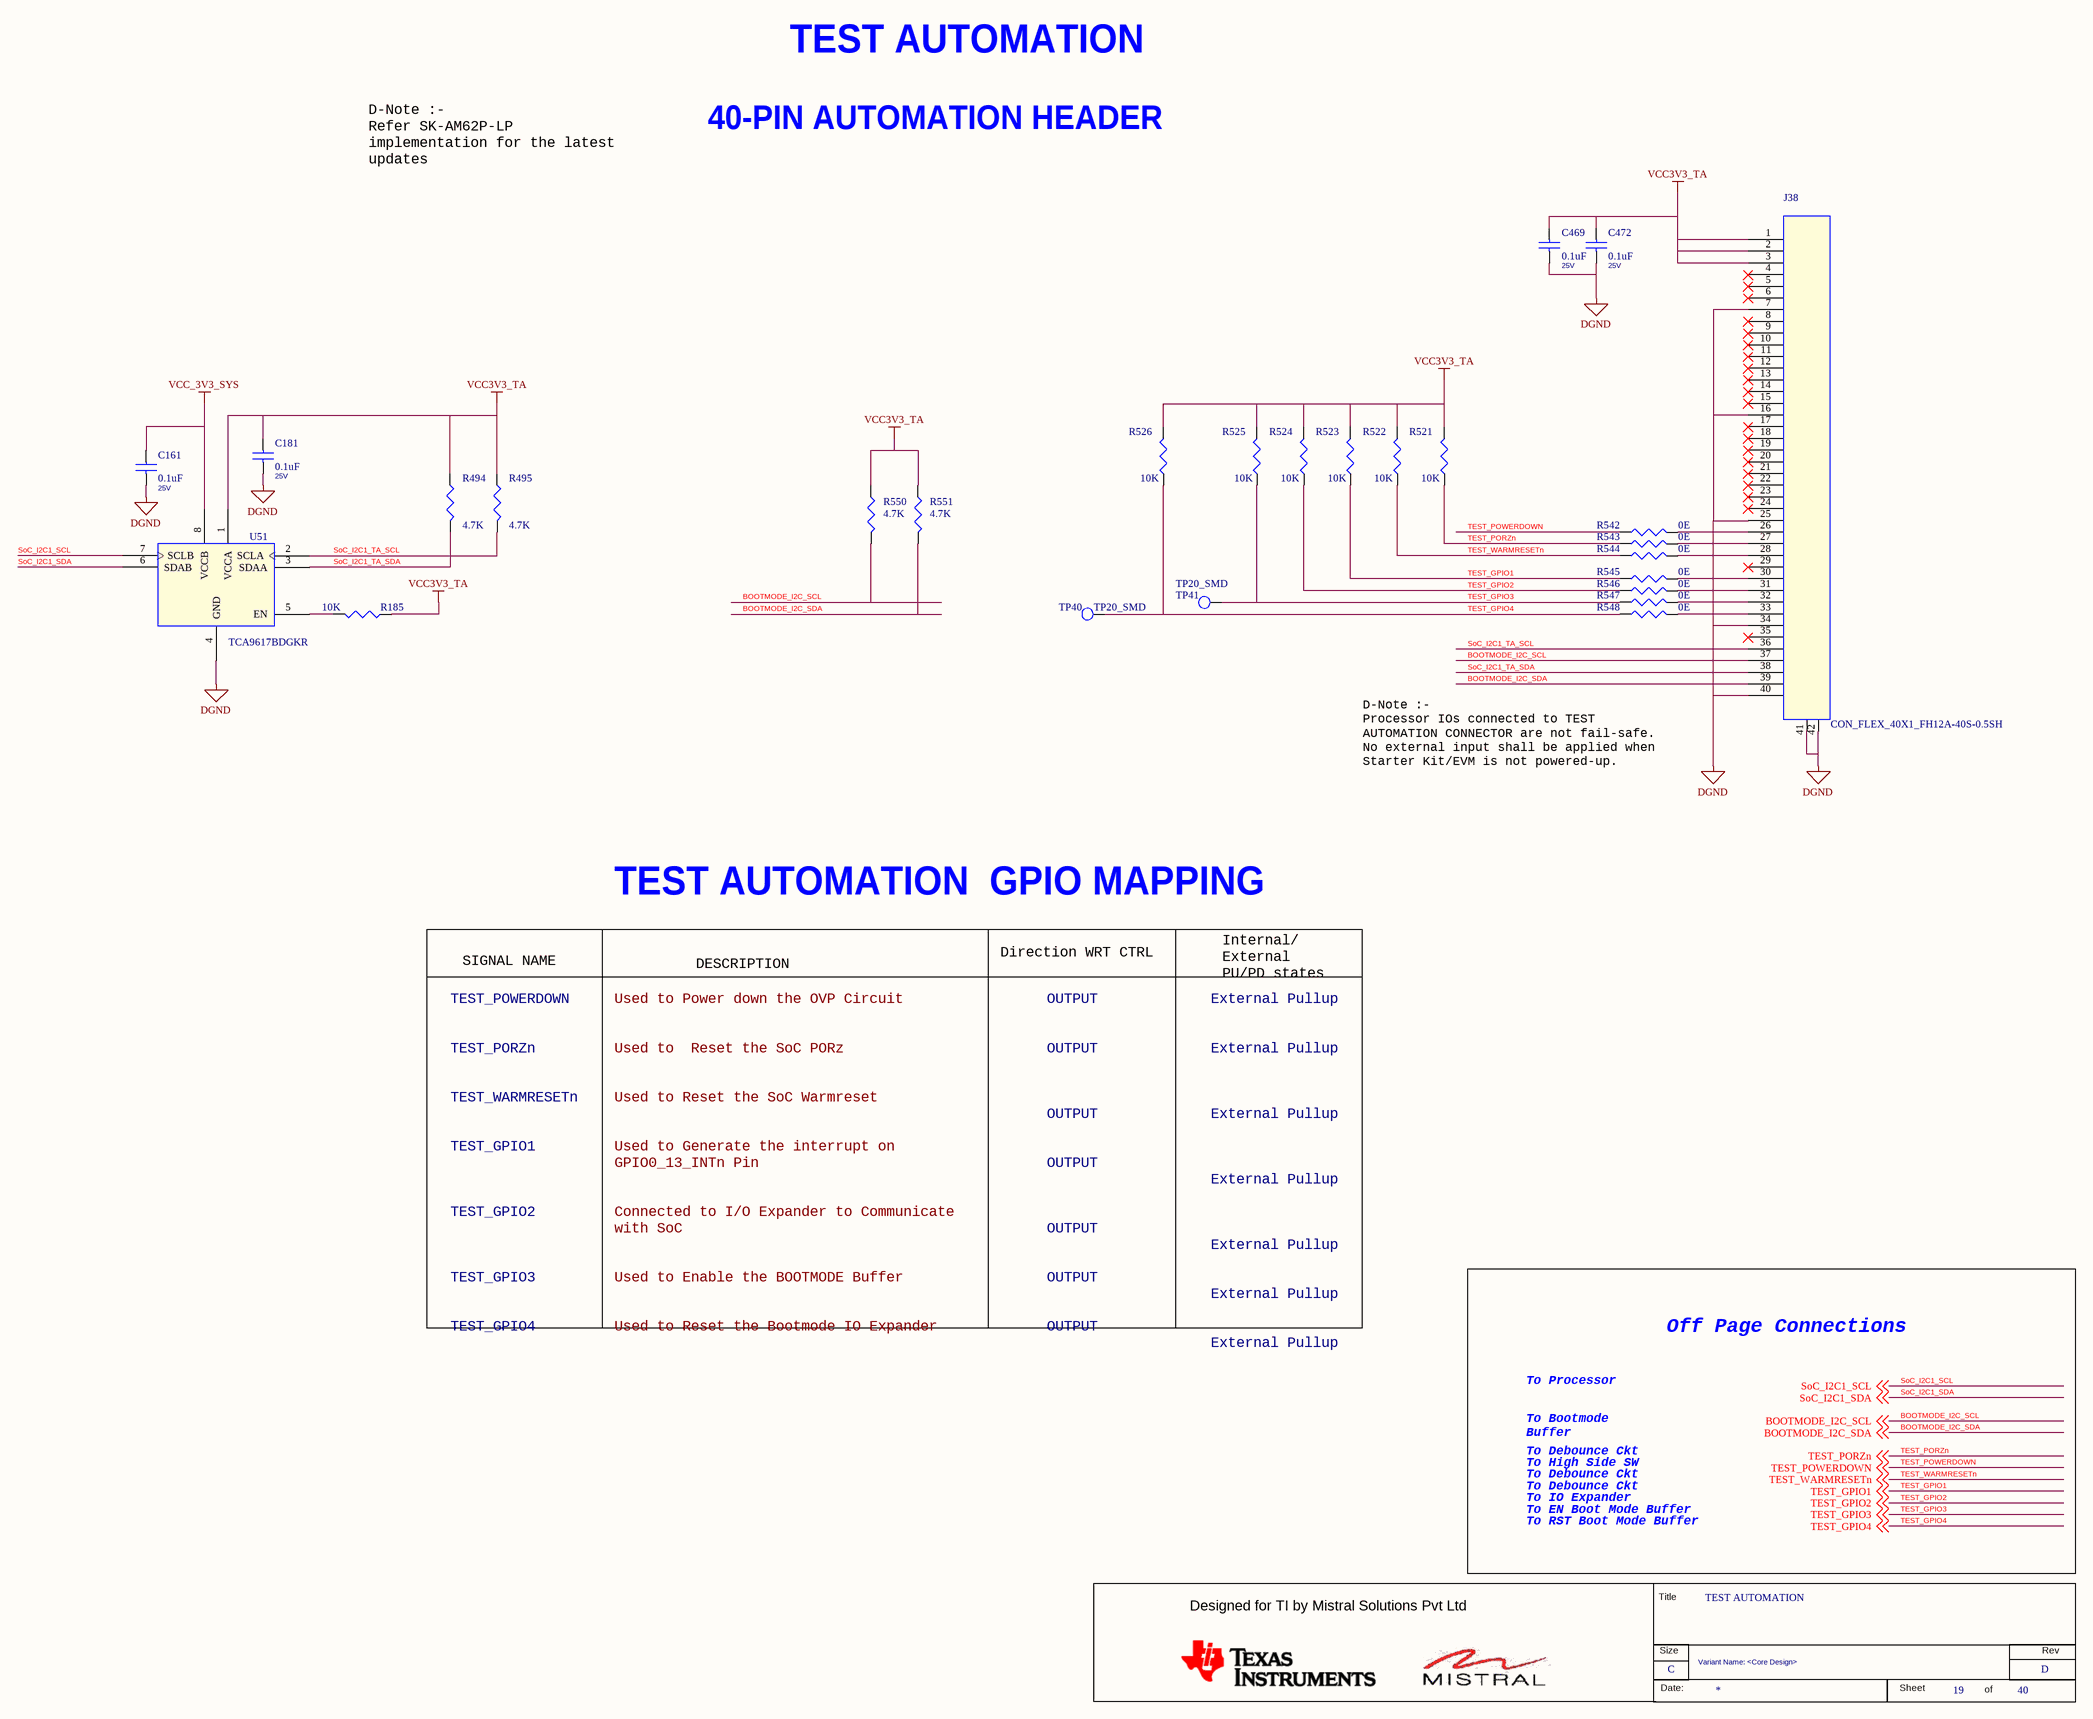
[diagram p29: 19.SchDoc]

### Parts
(Parts that share a designator on the sheet are numbered #1, #2 ... from top to bottom, then left to right.)
*#19  RevCode: D  Title: TEST AUTOMATION  Page Size: C  Page Number: 19  Page Count: 40  Variant Name: <Core Design>  (hidden comment: MISTRAL_TITLEBLK_CSIZE)  (graphical)
C161  0.1uF  Voltage: 25V  [CAP0402_0-75]
C181  0.1uF  Voltage: 25V  [CAP0402_0-75]
C469  0.1uF  Voltage: 25V  [CAP0402_0-75]
C472  0.1uF  Voltage: 25V  [CAP0402_0-75]
J38  CON_FLEX_40X1_FH12A-40S-0.5SH  [CON_FLEX40X1_FH12A_S_R_S]
R185  10K  [RES0402_0-5]
R494  4.7K  [RES0402_0-5]
R495  4.7K  [RES0402_0-5]
R521  10K  [RES0402_0-5]
R522  10K  [RES0402_0-5]
R523  10K  [RES0402_0-5]
R524  10K  [RES0402_0-5]
R525  10K  [RES0402_0-5]
R526  10K  [RES0402_0-5]
R542  0E  [RES0402_0-5]
R543  0E  [RES0402_0-5]
R544  0E  [RES0402_0-5]
R545  0E  [RES0402_0-5]
R546  0E  [RES0402_0-5]
R547  0E  [RES0402_0-5]
R548  0E  [RES0402_0-5]
R550  4.7K  [RES0402_0-5]
R551  4.7K  [RES0402_0-5]
TP40  TP20_SMD  [TP20_SMD]
TP41  TP20_SMD  [TP20_SMD]
U51  TCA9617BDGKR  [VSSOP8_25-59_120X120_1-1]

### Nets
DGND: C161.2 C181.2 C469.2 C472.2 J38.7 J38.16 J38.25 J38.34 J38.40 J38.41 J38.42 U51.4(GND)
VCC3V3_TA: C181.1 C469.1 C472.1 J38.1 J38.2 J38.3 R185.2 R494.1 R495.1 R521.2 R522.2 R523.2 R524.2 R525.2 R526.2 R550.1 R551.1 U51.1(VCCA)  [project net VOUT_TA]
VCC_3V3_SYS: C161.1 U51.8(VCCB)
BOOTMODE_I2C_SCL: J38.37 R550.2 ; off-sheet BOOTMODE_I2C_SCL
BOOTMODE_I2C_SDA: J38.39 R551.2 ; off-sheet BOOTMODE_I2C_SDA
SoC_I2C1_SCL: U51.7(SCLB) ; off-sheet SoC_I2C1_SCL
SoC_I2C1_SDA: U51.6(SDAB) ; off-sheet SoC_I2C1_SDA
SoC_I2C1_TA_SCL: J38.36 R495.2 U51.2(SCLA)
SoC_I2C1_TA_SDA: J38.38 R494.2 U51.3(SDAA)
TEST_GPIO1: R523.1 R545.1 ; off-sheet TEST_GPIO1
TEST_GPIO2: R524.1 R546.1 ; off-sheet TEST_GPIO2
TEST_GPIO3: R525.1 R547.1 TP41.1(TP) ; off-sheet TEST_GPIO3
TEST_GPIO4: R526.1 R548.1 TP40.1(TP) ; off-sheet TEST_GPIO4
TEST_PORZn: R521.1 R543.1 ; off-sheet TEST_PORZn
TEST_POWERDOWN: R542.1 ; off-sheet TEST_POWERDOWN
TEST_WARMRESETn: R522.1 R544.1 ; off-sheet TEST_WARMRESETn
NetJ38_26: J38.26 R542.2
NetJ38_27: J38.27 R543.2
NetJ38_28: J38.28 R544.2
NetJ38_30: J38.30 R545.2
NetJ38_31: J38.31 R546.2
NetJ38_32: J38.32 R547.2
NetJ38_33: J38.33 R548.2
NetR185_1: R185.1 U51.5(EN)

Not connected (* = marked no-connect by the designer): J38 4* 5* 6* 8* 9* 10* 11* 12* 13* 14* 15* 17* 18* 19* 20* 21* 22* 23* 24* 29* 35*

### Notes on the sheet
- D-Note :-
  Refer SK-AM62P-LP
  implementation for the latest
  updates
- TEST AUTOMATION
- 40-PIN AUTOMATION HEADER
- D-Note :-
  Processor IOs connected to TEST
  AUTOMATION CONNECTOR are not fail-safe.
  No external input shall be applied when
  Starter Kit/EVM is not powered-up.
- TEST AUTOMATION  GPIO MAPPING
- SIGNAL NAME
- DESCRIPTION
- Direction WRT CTRL
- Internal/
  External
  PU/PD states
- TEST_POWERDOWN
  TEST_PORZn
  TEST_WARMRESETn
  TEST_GPIO1
  TEST_GPIO2
  TEST_GPIO3
  TEST_GPIO4
- Used to Power down the OVP Circuit
  Used to  Reset the SoC PORz
  Used to Reset the SoC Warmreset
  Used to Generate the interrupt on
  GPIO0_13_INTn Pin
  Connected to I/O Expander to Communicate
  with SoC
  Used to Enable the BOOTMODE Buffer
  Used to Reset the Bootmode IO Expander
- OUTPUT
  OUTPUT
  OUTPUT
  OUTPUT
  OUTPUT
  OUTPUT
  OUTPUT
- External Pullup
  External Pullup
  External Pullup
  External Pullup
  External Pullup
  External Pullup
  External Pullup
- To Processor
- Off Page Connections
- To Bootmode
  Buffer
- To Debounce Ckt
- To IO Expander
- To High Side SW
- To RST Boot Mode Buffer
- To EN Boot Mode Buffer
- (in symbol MISTRAL_TITLEBLK_CSIZE) Title; Designed for TI by Mistral Solutions Pvt Ltd; Size; Rev; Date:; Sheet; of

### Library data of the parts
*#19 = MISTRAL_TITLEBLK_CSIZE: Issue: 1.0; Page Create Date: March  8, 1995; Page Modify Date: *
C161 C469 C472 = CAP_Dup3: as C89 on sheet 17; PCB Footprint: CAP0402_0-75; Tolerance: 20%; Package: 0402; Distributor_name: DIGIKEY; Distributor_part_number: 732-7495-1-ND; Height: 0.55MM; Weight: 0.65mg; Temperature: -55癈+85癈; Datasheet: Y:\MIS_DATABASE\DATASHEETS\CAPACITORS\885012105018.PDF; Crtd /date: ALVY/170820; Chkd/date: MANIRAJA/170820; MECHANICAL 3D STEP FILE: CAP0402_0-75; Library Ref: CAP; Footprint Ref: CAP0402_0-75; Library Path: Y:\MIS_DATABASE\Library\ALTIUM_TOOL\SCHEMATICS_PARTS\MS_DISCRETE_Library.schlib; Footprint Path: Y:\MIS_DATABASE\Library\ALTIUM_TOOL\PCB_FOOTPRINTS\Altium_Footprint_Lib.PcbLib
C181 = CAP_Dup3: as C67 on sheet 18; PCB Footprint: CAP0402_0-75; Footprint Path: Y:\MIS_DATABASE\Library\ALTIUM_TOOL\PCB_FOOTPRINTS\Altium_Footprint_Lib.PcbLib; Library Path: Y:\MIS_DATABASE\Library\ALTIUM_TOOL\SCHEMATICS_PARTS\MS_DISCRETE_Library.schlib; Footprint Ref: CAP0402_0-75; Library Ref: CAP; MECHANICAL 3D STEP FILE: CAP0402_0-75; Chkd/date: MANIRAJA/170820; Crtd /date: ALVY/170820; Datasheet: Y:\MIS_DATABASE\DATASHEETS\CAPACITORS\885012105018.PDF; Temperature: -55癈+85癈; Weight: 0.65mg; Height: 0.55MM; Distributor_part_number: 732-7495-1-ND; Distributor_name: DIGIKEY; Package: 0402; Tolerance: 20%
J38 = CON_FLEX_40X1_FH12A-40S-0.5SH: CON FPC 40X1 0.50MM PITCH RT TOP SMD; Mistral Part No: 150009030176-R; Mfr_name: HIROSE ELECTRIC EUROPE; Mfr_part_number: FH12A-40S-0.5SH(55); Part_type: CONNECTOR\FPC; Project: PMP LCD BOARD; Customs_HS_Code: 85369090; Custom_Duty: 24%; PCB Footprint: CON_FLEX40X1_FH12A_S_R_S; Package: SMD; Distributor_name: DIGIKEY; Distributor_part_number: HFK40CT-ND; Height: 2.00MM; Datasheet: Y:\MIS_DATABASE\DATASHEETS\CONNECTORS\FH12SERIES.PDF; Crtd /date: MAZHAR/171106; Chkd/date: SHREESHAIL/201106; Library Ref: CON_FLEX_40X1_FH12A-40S-0.5SH
R185 R526 = RESISTOR_Dup6: as R121 on sheet 17; MECHANICAL 3D STEP FILE: RES0402_0-5; Chkd/date: VASANTHA/061216; Crtd /date: MAZHAR/230805; Datasheet: Y:\MIS_DATABASE\DATASHEETS\RESISTORS\RCXXXXL-SER_MAR18.PDF; Temperature: -55癈+155癈; Weight: 0.65mg; Height: 0.40MM; Distributor_part_number: 311-10KJRCT-ND; Distributor_name: DIGIKEY; Package: 0402; Wattage: 1/16W; Tolerance: 5%; Library Ref: RESISTOR; Footprint Ref: RES0402_0-5; Library Path: Y:\MIS_DATABASE\Library\ALTIUM_TOOL\SCHEMATICS_PARTS\MS_DISCRETE_Library.schlib; Footprint Path: Y:\MIS_DATABASE\Library\ALTIUM_TOOL\PCB_FOOTPRINTS\Altium_Footprint_Lib.PcbLib; PCB Footprint: RES0402_0-5
R494 R495 R550 R551 = RESISTOR_Dup6: RES 4.7K 1/16W 5% 0402; Mistral Part No: 110011060001-R; Mfr_name: YAGEO AMERICA; Mfr_part_number: RC0402JR-074K7L; Part_type: RESISTORS\FIXED; Project: TMDXCSK368; Voltage: NA; Customs_HS_Code: 85332119; Custom_Duty: 15%; Tolerance: 5%; Wattage: 1/16W; Package: 0402; Distributor_name: DIGIKEY; Distributor_part_number: 311-4.7KJRCT-ND; Height: 0.40MM; Weight: 0.65mg; Temperature: -55癈+155癈; Datasheet: Y:\MIS_DATABASE\DATASHEETS\RESISTORS\RCXXXXL-SER_MAR18.PDF; Crtd /date: VASANTHA/130516; Chkd/date: VASANTHA/130516; Library Ref: RESISTOR; Footprint Ref: RES0402_0-5; MECHANICAL 3D STEP FILE: RES0402_0-5; Library Path: Y:\MIS_DATABASE\Library\ALTIUM_TOOL\SCHEMATICS_PARTS\MS_DISCRETE_Library.schlib; Footprint Path: Y:\MIS_DATABASE\Library\ALTIUM_TOOL\PCB_FOOTPRINTS\Altium_Footprint_Lib.PcbLib; PCB Footprint: RES0402_0-5
R521-R525 = RESISTOR_Dup6: as R120 on sheet 17; Footprint Path: Y:\MIS_DATABASE\Library\ALTIUM_TOOL\PCB_FOOTPRINTS\Altium_Footprint_Lib.PcbLib; Library Path: Y:\MIS_DATABASE\Library\ALTIUM_TOOL\SCHEMATICS_PARTS\MS_DISCRETE_Library.schlib; Footprint Ref: RES0402_0-5; Library Ref: RESISTOR; Tolerance: 5%; Wattage: 1/16W; Package: 0402; Distributor_name: DIGIKEY; Distributor_part_number: 311-10KJRCT-ND; Height: 0.40MM; Weight: 0.65mg; Temperature: -55癈+155癈; Datasheet: Y:\MIS_DATABASE\DATASHEETS\RESISTORS\RCXXXXL-SER_MAR18.PDF; Crtd /date: MAZHAR/230805; Chkd/date: VASANTHA/061216; MECHANICAL 3D STEP FILE: RES0402_0-5; PCB Footprint: RES0402_0-5
R542 R544-R546 R548 = RESISTOR_Dup5: as R324 on sheet 17; PCB Footprint: RES0402_0-5; Footprint Path: Y:\MIS_DATABASE\Library\ALTIUM_TOOL\PCB_FOOTPRINTS\Altium_Footprint_Lib.PcbLib; Library Path: Y:\MIS_DATABASE\Library\ALTIUM_TOOL\SCHEMATICS_PARTS\MS_DISCRETE_Library.schlib; Footprint Ref: RES0402_0-5; Library Ref: RESISTOR; Chkd/date: VASANTHA/201216; Crtd /date: MUDDU/190810; Datasheet: Y:\MIS_DATABASE\DATASHEETS\RESISTORS\CRCW0603.PDF; Temperature: -55癈+155癈; Weight: 0.65mg; Height: 0.40MM; Distributor_part_number: 541-0.0JCT-ND; Distributor_name: DIGIKEY; Package: 0402; Wattage: 1/16W; Tolerance: NA; MECHANICAL 3D STEP FILE: RES0402_0-5
R543 R547 = RESISTOR_Dup5: as R99 on sheet 18; PCB Footprint: RES0402_0-5; Footprint Path: Y:\MIS_DATABASE\Library\ALTIUM_TOOL\PCB_FOOTPRINTS\Altium_Footprint_Lib.PcbLib; Library Path: Y:\MIS_DATABASE\Library\ALTIUM_TOOL\SCHEMATICS_PARTS\MS_DISCRETE_Library.schlib; Footprint Ref: RES0402_0-5; Library Ref: RESISTOR; Voltage: NA; Wattage: 1/16W; Package: 0402; Distributor_name: DIGIKEY; Distributor_part_number: 541-0.0JCT-ND; Height: 0.40MM; Weight: 0.65mg; Temperature: -55癈+155癈; Datasheet: Y:\MIS_DATABASE\DATASHEETS\RESISTORS\CRCW0603.PDF; Crtd /date: MUDDU/190810; Chkd/date: VASANTHA/201216; MECHANICAL 3D STEP FILE: RES0402_0-5
TP40 TP41 = TESTPOINT: as TP69 on sheet 17; Customs_HS_Code: NA; PCB Footprint: TP20_SMD; RoHS: NA; Footprint Ref: TP20_SMD; Library Ref: TESTPOINT; Mistral Part No: NA; Mfr_part_number: TP20_SMD; Part_type: TESTPOINT; Package: SMD; Distributor_name: NA; Distributor_part_number: NA; Height: NA; Crtd /date: MAZHAR/171006; Chkd/date: SHREESHAIL/171006; Tolerance: NA; Voltage: NA; Wattage: NA; Weight: NA; Temperature: NA; Datasheet: NA; MECHANICAL 3D STEP FILE: NA; Library Path: Y:\MIS_DATABASE\Library\ALTIUM_TOOL\SCHEMATICS_PARTS\MS_DISCRETE_Library.schlib; Footprint Path: Y:\MIS_DATABASE\Library\ALTIUM_TOOL\PCB_FOOTPRINTS\Altium_Footprint_Lib.PcbLib
U51 = TCA9617BDGKR_VSSOP8: IC FM+I2C BUS REPEATER LEVEL TRANSLATOR VSSOP8; Mistral Part No: 141017100010-R; Mfr_name: TEXAS INSTRUMENTS; Part_type: ICS\INTERFACE\LEVEL TRANSLATOR; Project: TI_MAXIE_CPB; Tolerance: NA; Customs_HS_Code: 85423100; Custom_Duty: 15%; Mfr_part_number: TCA9617BDGKR; Voltage: NA; Wattage: NA; Package: VSSOP8; Distributor_name: DIGIKEY; Distributor_part_number: 296-40579-1-ND; Library Ref: TCA9617BDGKR_VSSOP8; Height: 1.10MM; Weight: NA; Temperature: -40癈+85癈; Datasheet: Y:\MIS_DATABASE\DATASHEETS\ICS\INTERFACE\TCA9617B.PDF; Crtd /date: MANIRAJA/131017; Chkd/date: MANIRAJA/131017; MECHANICAL 3D STEP FILE: VSSOP8_25-59_120X120_1-1; PCB Footprint: VSSOP8_25-59_120X120_1-1